# Altium schematic sheet fpga-rx2.SchDoc: Receiver FPGA
size Legal; CheckedBy: J. Brinton; CompanyName: Signal Laboratories, Inc.; DrawnBy: J. Brinton; Engineer: J. Brinton; Address1: 3479 Edison Way; Address2: Menlo Park CA 94025; Address3: +1 (877) 778-8435; Address4: siglabs.com; DocumentNumber: 40; Revision: 2b; SheetNumber: 41; SheetTotal: 58
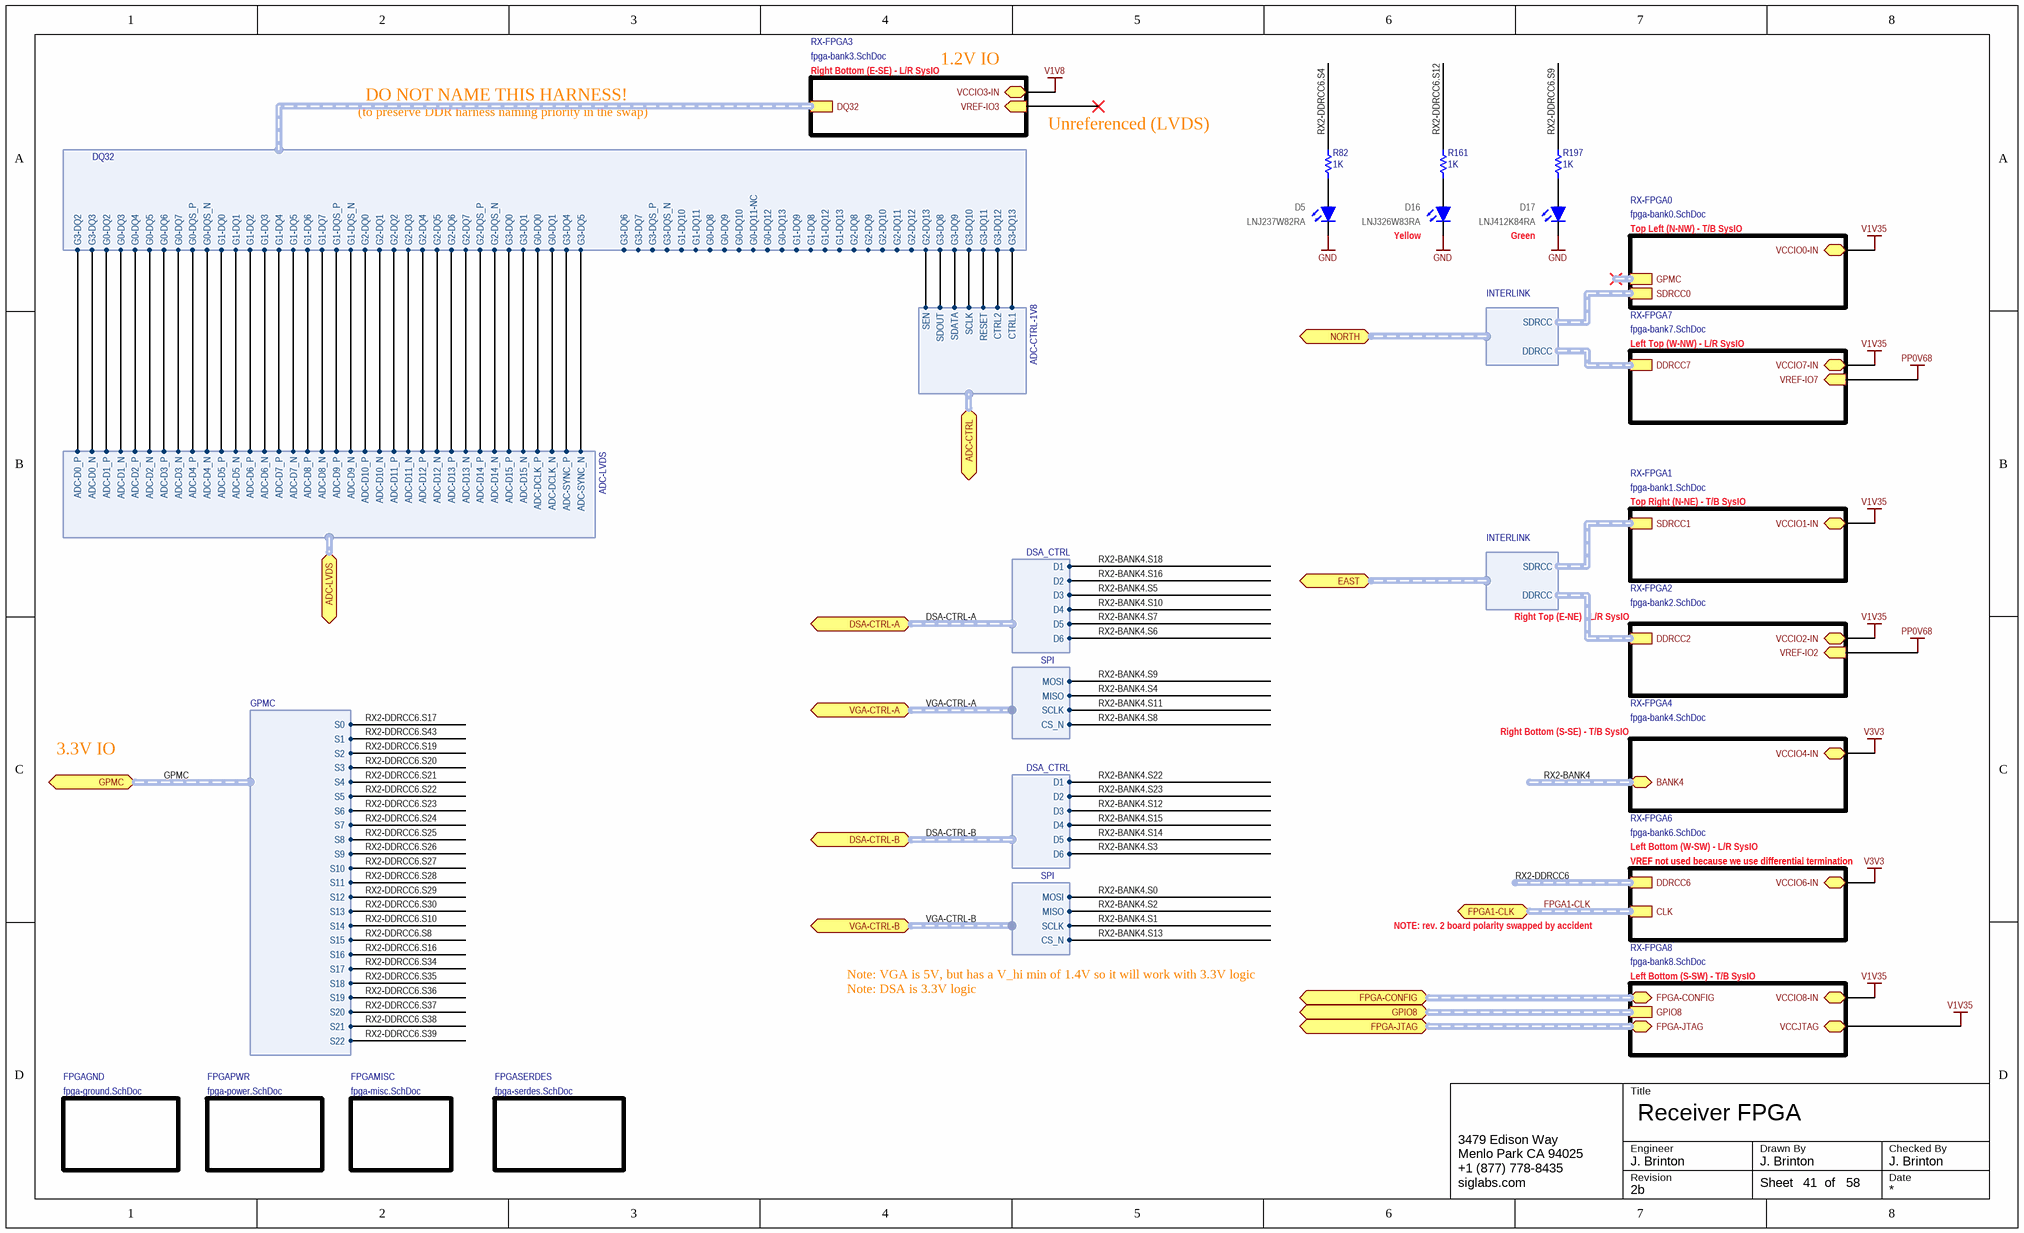
[diagram p0: fpga-rx2.SchDoc]

## Parts
D5  LNJ237W82RA  [0603_LED]
D16  LNJ326W83RA  [0603_LED]
D17  LNJ412K84RA  [0603_LED]
R82  value 1K  [0402]  (hidden comment: RC0402FR-071KL)
R161  value 1K  [0402]  (hidden comment: RC0402FR-071KL)
R197  value 1K  [0402]  (hidden comment: RC0402FR-071KL)

## Sub-sheets
FPGAGND = fpga-ground.SchDoc: no entries
FPGAMISC = fpga-misc.SchDoc: no entries
FPGAPWR = fpga-power.SchDoc: no entries
FPGASERDES = fpga-serdes.SchDoc: no entries
RX-FPGA0 = fpga-bank0.SchDoc: GPMC (harness GPMC), SDRCC0 (harness SDRCC), VCCIO0-IN
RX-FPGA1 = fpga-bank1.SchDoc: SDRCC1 (harness SDRCC), VCCIO1-IN
RX-FPGA2 = fpga-bank2.SchDoc: DDRCC2 (harness DDRCC), VCCIO2-IN, VREF-IO2 (in)
RX-FPGA3 = fpga-bank3.SchDoc: DQ32 (harness DQ32), VREF-IO3 (in), VCCIO3-IN
RX-FPGA4 = fpga-bank4.SchDoc: VCCIO4-IN, BANK4 (harness BANK4)
RX-FPGA6 = fpga-bank6.SchDoc: DDRCC6 (harness DDRCC), VCCIO6-IN, CLK (harness CLK-LVPECL33)
RX-FPGA7 = fpga-bank7.SchDoc: DDRCC7 (harness DDRCC), VREF-IO7 (in), VCCIO7-IN
RX-FPGA8 = fpga-bank8.SchDoc: GPIO8 (harness GPIO8), FPGA-CONFIG (harness CONF_1V5), FPGA-JTAG (harness FPGA-JTAG), VCCJTAG, VCCIO8-IN

## Ports
ADC-CTRL (harness ADC-CTRL-1V8), ADC-LVDS (harness ADC-LVDS), DSA-CTRL-A (harness DSA_CTRL), DSA-CTRL-B (harness DSA_CTRL), EAST (harness INTERLINK), FPGA1-CLK (harness CLK-LVPECL33), FPGA-CONFIG (harness CONF_1V5), FPGA-JTAG (harness FPGA-JTAG), GPIO8 (harness GPIO8), GPMC (harness GPMC), NORTH (harness INTERLINK), VGA-CTRL-A (harness SPI), VGA-CTRL-B (harness SPI)

## Harnesses
INTERLINK: SDRCC, DDRCC
GPMC: S0, S1, S2, S3, S4, S5, S6, S7, S8, S9, S10, S11, S12, S13, S14, S15, S16, S17, S18, S19, S20, S21, S22
ADC-LVDS: ADC-D0_P, ADC-D0_N, ADC-D1_P, ADC-D1_N, ADC-D2_P, ADC-D2_N, ADC-D3_P, ADC-D3_N, ADC-D4_P, ADC-D4_N, ADC-D5_P, ADC-D5_N, ADC-D6_P, ADC-D6_N, ADC-D7_P, ADC-D7_N, ADC-D8_P, ADC-D8_N, ADC-D9_P, ADC-D9_N, ADC-D10_P, ADC-D10_N, ADC-D11_P, ADC-D11_N, ADC-D12_P, ADC-D12_N, ADC-D13_P, ADC-D13_N, ADC-D14_P, ADC-D14_N, ADC-D15_P, ADC-D15_N, ADC-DCLK_P, ADC-DCLK_N, ADC-SYNC_P, ADC-SYNC_N
DSA_CTRL: D3, D4, D5, D6, D2, D1
DQ32: G0-DQS_P, G0-DQS_N, G0-DQ0, G0-DQ1, G0-DQ2, G0-DQ3, G0-DQ4, G0-DQ5, G0-DQ6, G0-DQ7, G0-DQ8, G0-DQ9, G0-DQ10, G0-DQ11-NC, G0-DQ12, G0-DQ13, G1-DQS_P, G1-DQS_N, G1-DQ0, G1-DQ1, G1-DQ2, G1-DQ3, G1-DQ4, G1-DQ5, G1-DQ6, G1-DQ7, G1-DQ8, G1-DQ9, G1-DQ10, G1-DQ11, G1-DQ12, G1-DQ13, G2-DQS_P, G2-DQS_N, G2-DQ0, G2-DQ1, G2-DQ2, G2-DQ3, G2-DQ4, G2-DQ5, G2-DQ6, G2-DQ7, G2-DQ8, G2-DQ9, G2-DQ10, G2-DQ11, G2-DQ12, G2-DQ13, G3-DQS_P, G3-DQS_N, G3-DQ0, G3-DQ1, G3-DQ2, G3-DQ3, G3-DQ4, G3-DQ5, G3-DQ6, G3-DQ7, G3-DQ8, G3-DQ9, G3-DQ10, G3-DQ11, G3-DQ12, G3-DQ13
SPI: CS_N, MISO, MOSI, SCLK
ADC-CTRL-1V8: CTRL1, CTRL2, RESET, SCLK, SDATA, SDOUT, SEN

## Nets
GND: D5.2(K) D16.2(K) D17.2(K)
PP0V68: sheet RX-FPGA2/VREF-IO2, sheet RX-FPGA7/VREF-IO7
V1V8: sheet RX-FPGA3/VCCIO3-IN
V1V35: sheet RX-FPGA0/VCCIO0-IN, sheet RX-FPGA1/VCCIO1-IN, sheet RX-FPGA2/VCCIO2-IN, sheet RX-FPGA7/VCCIO7-IN, sheet RX-FPGA8/VCCJTAG, sheet RX-FPGA8/VCCIO8-IN
V3V3: sheet RX-FPGA4/VCCIO4-IN, sheet RX-FPGA6/VCCIO6-IN
RX2-BANK4.S0: port VGA-CTRL-B.MOSI
RX2-BANK4.S1: port VGA-CTRL-B.SCLK
RX2-BANK4.S2: port VGA-CTRL-B.MISO
RX2-BANK4.S3: port DSA-CTRL-B.D6  [project net DSA-CTRL-B.D6]
RX2-BANK4.S4: port VGA-CTRL-A.MISO
RX2-BANK4.S5: port DSA-CTRL-A.D3  [project net DSA-CTRL-A.D3]
RX2-BANK4.S6: port DSA-CTRL-A.D6  [project net DSA-CTRL-A.D6]
RX2-BANK4.S7: port DSA-CTRL-A.D5  [project net DSA-CTRL-A.D5]
RX2-BANK4.S8: port VGA-CTRL-A.CS_N
RX2-BANK4.S9: port VGA-CTRL-A.MOSI
RX2-BANK4.S10: port DSA-CTRL-A.D4  [project net DSA-CTRL-A.D4]
RX2-BANK4.S11: port VGA-CTRL-A.SCLK
RX2-BANK4.S12: port DSA-CTRL-B.D3  [project net DSA-CTRL-B.D3]
RX2-BANK4.S13: port VGA-CTRL-B.CS_N
RX2-BANK4.S14: port DSA-CTRL-B.D5  [project net DSA-CTRL-B.D5]
RX2-BANK4.S15: port DSA-CTRL-B.D4  [project net DSA-CTRL-B.D4]
RX2-BANK4.S16: port DSA-CTRL-A.D2  [project net DSA-CTRL-A.D2]
RX2-BANK4.S18: port DSA-CTRL-A.D1  [project net DSA-CTRL-A.D1]
RX2-BANK4.S22: port DSA-CTRL-B.D1  [project net DSA-CTRL-B.D1]
RX2-BANK4.S23: port DSA-CTRL-B.D2  [project net DSA-CTRL-B.D2]
RX2-DDRCC6.S4: R82.2
RX2-DDRCC6.S8: port GPMC.S15  [project net GPMC.S15]
RX2-DDRCC6.S9: R197.2
RX2-DDRCC6.S10: port GPMC.S14  [project net GPMC.S14]
RX2-DDRCC6.S12: R161.2
RX2-DDRCC6.S16: port GPMC.S16  [project net GPMC.S16]
RX2-DDRCC6.S17: port GPMC.S0  [project net GPMC.S0]
RX2-DDRCC6.S19: port GPMC.S2  [project net GPMC.S2]
RX2-DDRCC6.S20: port GPMC.S3  [project net GPMC.S3]
RX2-DDRCC6.S21: port GPMC.S4  [project net GPMC.S4]
RX2-DDRCC6.S22: port GPMC.S5  [project net GPMC.S5]
RX2-DDRCC6.S23: port GPMC.S6  [project net GPMC.S6]
RX2-DDRCC6.S24: port GPMC.S7  [project net GPMC.S7]
RX2-DDRCC6.S25: port GPMC.S8  [project net GPMC.S8]
RX2-DDRCC6.S26: port GPMC.S9  [project net GPMC.S9]
RX2-DDRCC6.S27: port GPMC.S10  [project net GPMC.S10]
RX2-DDRCC6.S28: port GPMC.S11  [project net GPMC.S11]
RX2-DDRCC6.S29: port GPMC.S12  [project net GPMC.S12]
RX2-DDRCC6.S30: port GPMC.S13  [project net GPMC.S13]
RX2-DDRCC6.S34: port GPMC.S17  [project net GPMC.S17]
RX2-DDRCC6.S35: port GPMC.S18  [project net GPMC.S18]
RX2-DDRCC6.S36: port GPMC.S19  [project net GPMC.S19]
RX2-DDRCC6.S37: port GPMC.S20  [project net GPMC.S20]
RX2-DDRCC6.S38: port GPMC.S21  [project net GPMC.S21]
RX2-DDRCC6.S39: port GPMC.S22  [project net GPMC.S22]
RX2-DDRCC6.S43: port GPMC.S1  [project net GPMC.S1]
NetD5_1: D5.1(A) R82.1
NetD16_1: D16.1(A) R161.1
NetD17_1: D17.1(A) R197.1
(unnamed): port ADC-LVDS.ADC-D0_P, sheet RX-FPGA3/DQ32.G3-DQ2
(unnamed): port ADC-LVDS.ADC-D0_N, sheet RX-FPGA3/DQ32.G3-DQ3
(unnamed): port ADC-LVDS.ADC-D1_P, sheet RX-FPGA3/DQ32.G0-DQ2
(unnamed): port ADC-LVDS.ADC-D1_N, sheet RX-FPGA3/DQ32.G0-DQ3
(unnamed): port ADC-LVDS.ADC-D2_P, sheet RX-FPGA3/DQ32.G0-DQ4
(unnamed): port ADC-LVDS.ADC-D2_N, sheet RX-FPGA3/DQ32.G0-DQ5
(unnamed): port ADC-LVDS.ADC-D3_P, sheet RX-FPGA3/DQ32.G0-DQ6
(unnamed): port ADC-LVDS.ADC-D3_N, sheet RX-FPGA3/DQ32.G0-DQ7
(unnamed): port ADC-LVDS.ADC-D4_P, sheet RX-FPGA3/DQ32.G0-DQS_P
(unnamed): port ADC-LVDS.ADC-D4_N, sheet RX-FPGA3/DQ32.G0-DQS_N
(unnamed): port ADC-LVDS.ADC-D5_P, sheet RX-FPGA3/DQ32.G1-DQ0
(unnamed): port ADC-LVDS.ADC-D5_N, sheet RX-FPGA3/DQ32.G1-DQ1
(unnamed): port ADC-LVDS.ADC-D6_P, sheet RX-FPGA3/DQ32.G1-DQ2
(unnamed): port ADC-LVDS.ADC-D6_N, sheet RX-FPGA3/DQ32.G1-DQ3
(unnamed): port ADC-LVDS.ADC-D7_P, sheet RX-FPGA3/DQ32.G1-DQ4
(unnamed): port ADC-LVDS.ADC-D7_N, sheet RX-FPGA3/DQ32.G1-DQ5
(unnamed): port ADC-LVDS.ADC-D8_P, sheet RX-FPGA3/DQ32.G1-DQ6
(unnamed): port ADC-LVDS.ADC-D8_N, sheet RX-FPGA3/DQ32.G1-DQ7
(unnamed): port ADC-LVDS.ADC-D9_P, sheet RX-FPGA3/DQ32.G1-DQS_P
(unnamed): port ADC-LVDS.ADC-D9_N, sheet RX-FPGA3/DQ32.G1-DQS_N
(unnamed): port ADC-LVDS.ADC-D10_P, sheet RX-FPGA3/DQ32.G2-DQ0
(unnamed): port ADC-LVDS.ADC-D10_N, sheet RX-FPGA3/DQ32.G2-DQ1
(unnamed): port ADC-LVDS.ADC-D11_P, sheet RX-FPGA3/DQ32.G2-DQ2
(unnamed): port ADC-LVDS.ADC-D11_N, sheet RX-FPGA3/DQ32.G2-DQ3
(unnamed): port ADC-LVDS.ADC-D12_P, sheet RX-FPGA3/DQ32.G2-DQ4
(unnamed): port ADC-LVDS.ADC-D12_N, sheet RX-FPGA3/DQ32.G2-DQ5
(unnamed): port ADC-LVDS.ADC-D13_P, sheet RX-FPGA3/DQ32.G2-DQ6
(unnamed): port ADC-LVDS.ADC-D13_N, sheet RX-FPGA3/DQ32.G2-DQ7
(unnamed): port ADC-LVDS.ADC-D14_P, sheet RX-FPGA3/DQ32.G2-DQS_P
(unnamed): port ADC-LVDS.ADC-D14_N, sheet RX-FPGA3/DQ32.G2-DQS_N
(unnamed): port ADC-LVDS.ADC-D15_P, sheet RX-FPGA3/DQ32.G3-DQ0
(unnamed): port ADC-LVDS.ADC-D15_N, sheet RX-FPGA3/DQ32.G3-DQ1
(unnamed): port ADC-LVDS.ADC-DCLK_P, sheet RX-FPGA3/DQ32.G0-DQ0
(unnamed): port ADC-LVDS.ADC-DCLK_N, sheet RX-FPGA3/DQ32.G0-DQ1
(unnamed): port ADC-LVDS.ADC-SYNC_P, sheet RX-FPGA3/DQ32.G3-DQ4
(unnamed): port ADC-LVDS.ADC-SYNC_N, sheet RX-FPGA3/DQ32.G3-DQ5
(unnamed): sheet RX-FPGA3/DQ32.G2-DQ13, port ADC-CTRL.SEN
(unnamed): sheet RX-FPGA3/DQ32.G3-DQ8, port ADC-CTRL.SDOUT
(unnamed): sheet RX-FPGA3/DQ32.G3-DQ9, port ADC-CTRL.SDATA
(unnamed): sheet RX-FPGA3/DQ32.G3-DQ10, port ADC-CTRL.SCLK
(unnamed): sheet RX-FPGA3/DQ32.G3-DQ11, port ADC-CTRL.RESET
(unnamed): sheet RX-FPGA3/DQ32.G3-DQ12, port ADC-CTRL.CTRL2
(unnamed): sheet RX-FPGA3/DQ32.G3-DQ13, port ADC-CTRL.CTRL1

## Buses and harness runs
harness DSA-CTRL-A = port DSA-CTRL-A
harness DSA-CTRL-B = port DSA-CTRL-B
harness FPGA1-CLK = port FPGA1-CLK = sheet RX-FPGA6/CLK
harness GPMC = port GPMC
harness port FPGA-CONFIG = sheet RX-FPGA8/FPGA-CONFIG
harness port FPGA-JTAG = sheet RX-FPGA8/FPGA-JTAG
harness port GPIO8 = sheet RX-FPGA8/GPIO8
harness RX2-BANK4 = sheet RX-FPGA4/BANK4
harness RX2-DDRCC6 = sheet RX-FPGA6/DDRCC6
harness VGA-CTRL-A = port VGA-CTRL-A
harness VGA-CTRL-B = port VGA-CTRL-B

## Notes on the sheet
- DO NOT NAME THIS HARNESS!
- Right Bottom (E-SE) - L/R SysIO
- 1.2V IO
- (to preserve DDR harness naming priority in the swap)
- Unreferenced (LVDS)
- (near D16) Yellow
- (near D17) Green
- Top Left (N-NW) - T/B SysIO
- Left Top (W-NW) - L/R SysIO
- Top Right (N-NE) - T/B SysIO
- Right Top (E-NE) - L/R SysIO
- Right Bottom (S-SE) - T/B SysIO
- 3.3V IO
- Left Bottom (W-SW) - L/R SysIO
- VREF not used because we use differential termination
- NOTE: rev. 2 board polarity swapped by accident
- Note: VGA is 5V, but has a V_hi min of 1.4V so it will work with 3.3V logic
- Note: DSA is 3.3V logic
- Left Bottom (S-SW) - T/B SysIO
- Title
- Engineer
- Revision
- Drawn By
- Checked By
- Date
- Sheet
- of

## Library data of the parts
D5 = LED0603RD: LED, SMT 0603, Color Red, 5mA, 1.85V; Manufacturer: Panasonic; Manufacturer P/N: LNJ237W82RA; Package: 0603 Polarized
D16 = LED0603GR: LED, SMT 0603, Color Green, 10mA, 2.05V; Manufacturer: Panasonic; Manufacturer P/N: LNJ326W83RA; Package: 0603 Polarized
D17 = LED0603Y: LED, SMT 0603, Color Yellow, 10mA, 2.05V; Manufacturer: Panasonic; Manufacturer P/N: LNJ412K84RA; Package: 0603 Polarized
R82 R161 R197 = RES 0402: Thick Film Resistor 1k ±1% 0402; Manufacturer: Yageo; Tr: -55:155; Package: 0402; Manufacturer P/N: RC0402FR-071KL; Do Not Place: *; Tolerance: ±1%